# EAGLE design moodlight (EAGLE 6.5.0)
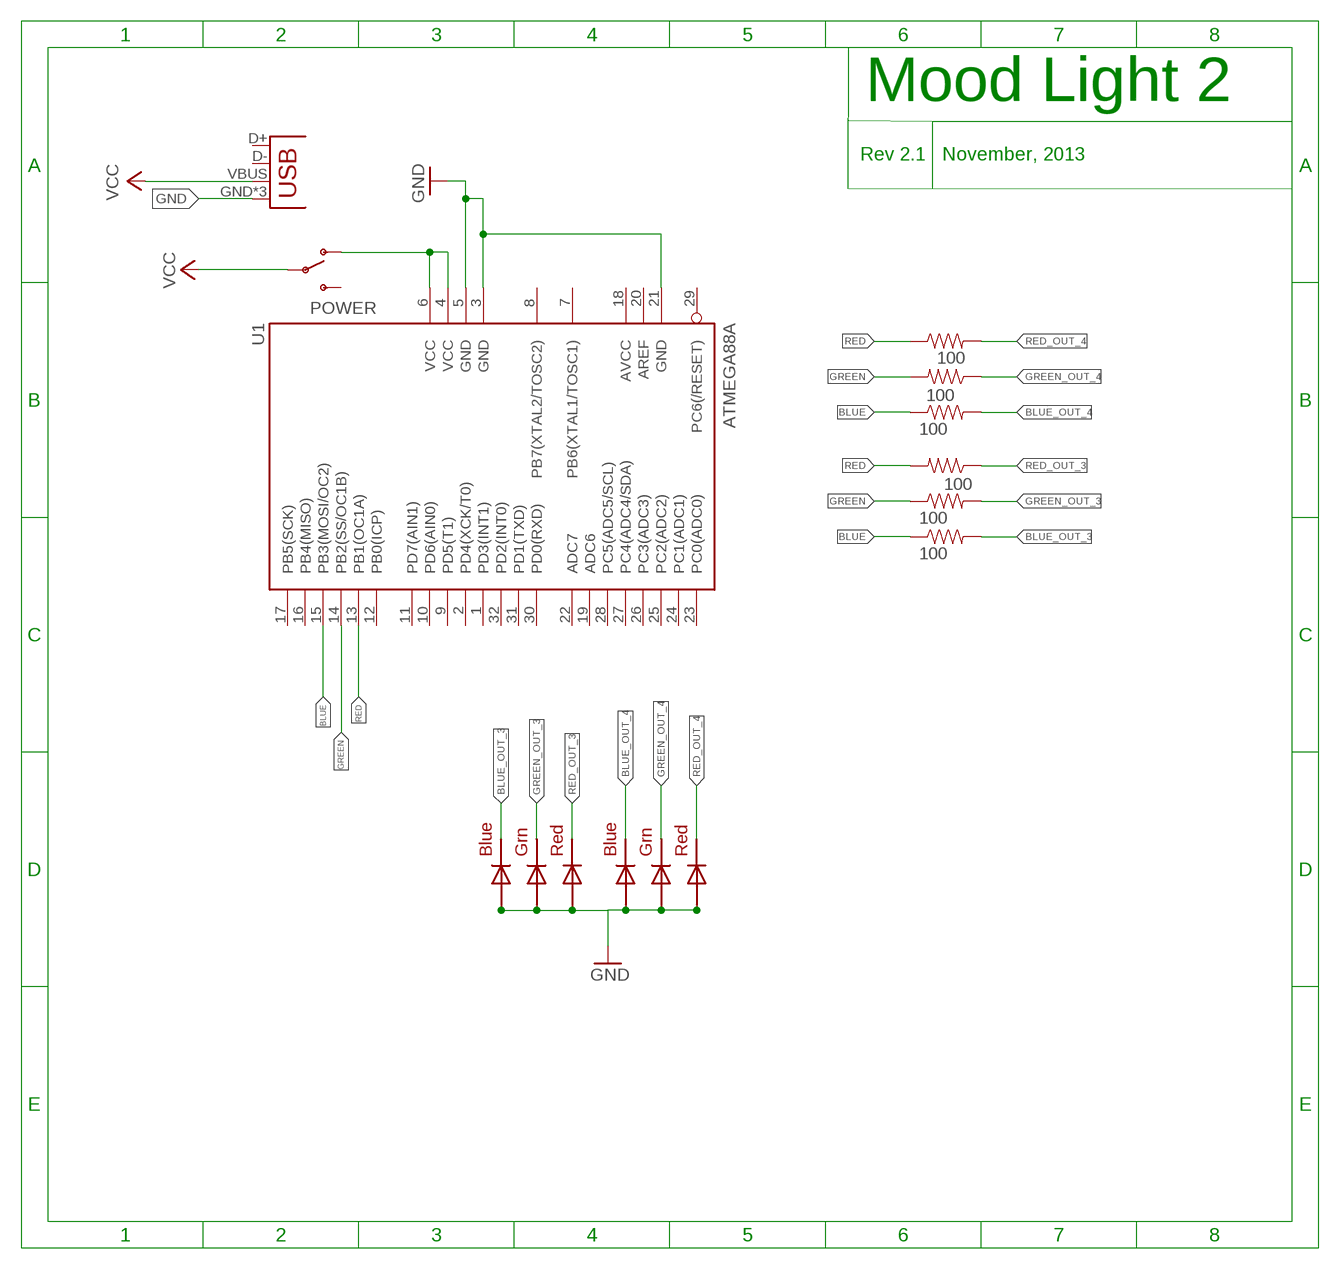
[diagram p0: schematic, sheet 1]

## Parts
JP2  USB-MICROB  [USB-MICROB]
LED3  RGBLED5050  [RGBLED5050]
LED4  RGBLED5050  [RGBLED5050]
POWER  5V  SWITCH-SPDTPTH  [SWITCH-SPDT]
R1  100  220-5%  [0603-RES]
R2  100  220-5%  [0603-RES]
R3  100  220-5%  [0603-RES]
R4  100  220-5%  [0603-RES]
R5  100  220-5%  [0603-RES]
R6  100  220-5%  [0603-RES]
U1  ATMEGA88A  MEGA8-AI  [TQFP32-08]

## Nets
BLUE: R3.1 R6.1 U1.15(PB3(MOSI/OC2))
BLUE_OUT_3: LED3.4(BLUE_C) R6.2
BLUE_OUT_4: LED4.4(BLUE_C) R3.2
GND: JP2.GND JP2.MT1(GND) JP2.MT2(GND) LED3.1(GREEN_A) LED3.2(RED_A) LED3.3(BLUE_A) LED4.1(GREEN_A) LED4.2(RED_A) LED4.3(BLUE_A) U1.3(GND) U1.5(GND) U1.21(GND)
GREEN: R2.2 R5.1 U1.14(PB2(SS/OC1B))
GREEN_OUT_3: LED3.6(GREEN_C) R5.2
GREEN_OUT_4: LED4.6(GREEN_C) R2.1
N$1: POWER.1(O) U1.4(VCC) U1.6(VCC)
RED: R1.1 R4.2 U1.13(PB1(OC1A))
RED_OUT_3: LED3.5(RED_C) R4.1
RED_OUT_4: LED4.5(RED_C) R1.2
VCC: JP2.VBUS POWER.2(P)
Unconnected: JP2.D+ JP2.D- POWER.3(S) U1.1(PD3(INT1)) U1.2(PD4(XCK/T0)) U1.7(PB6(XTAL1/TOSC1)) U1.8(PB7(XTAL2/TOSC2)) U1.9(PD5(T1)) U1.10(PD6(AIN0)) U1.11(PD7(AIN1)) U1.12(PB0(ICP)) U1.16(PB4(MISO)) U1.17(PB5(SCK)) U1.19(ADC6) U1.20(AREF) U1.22(ADC7) U1.23(PC0(ADC0)) U1.24(PC1(ADC1)) U1.25(PC2(ADC2)) U1.26(PC3(ADC3)) U1.27(PC4(ADC4/SDA)) U1.28(PC5(ADC5/SCL)) U1.29(PC6(/RESET)) U1.30(PD0(RXD)) U1.31(PD1(TXD)) U1.32(PD2(INT0))

## Notes on the sheet
- Mood Light 2
- Rev 2.1   November, 2013

## Power pins joined to a net without a drawn wire
AVCC: U1.18(AVCC)

## Library data of the parts
JP2 = SparkFun-Connectors:USB: USB Connectors USB-B-PTH is fully proven SKU : PRT-00139/CONN-08278 USB-miniB is fully proven SKU : PRT-00587 USB-A-PCB is untested. USB-A-H is throughly reviewed, but untested. Spark Fun Electronics SKU : PRT-00437 USB-B-SMT is throughly reviewed, but untested. Needs silkscreen touching up. USB-A-S has not been used/tested USB-MB-H has not been used/tested USB-MICROB has been used. CONN-09505; PROD_ID: CONN-09505
LED3 LED4 = adafruit:RGBLED: For 5050 RGB LEDs, the order of the LEDs may vary from one manufacturer to another!
POWER = SparkFun-Electromechanical:SWITCH-SPDT: SPDT Switch Simple slide switch, Spark Fun Electronics SKU : COM-00102 DPDT SMT slide switch, AYZ0202, SWCH-08179
R1-R6 = SparkFun-Resistors:220-5%: 220-ohm SMT 1/8W - 5% (0805) RES-07866; PROD_ID: RES-07866; VALUE: 220
U1 = atmel:MEGA8: MICROCONTROLLER 8 Kbytes FLASH, 1 kbytes SRAM, 512 bytes EEPROM, USART, 6-channel 10 bit ADC, 2-channel 8 bit ADC Pin compatible with Atmega48, ATMega88, ATMega168 Source: avr.lbr; MPN: ATMEGA8-16AU; OC_FARNELL: 9171371; OC_NEWARK: 73M8863

## Net classes
0 default: width 0.305 mm, drill 0.508 mm, clearance 0.254 mm

## Board
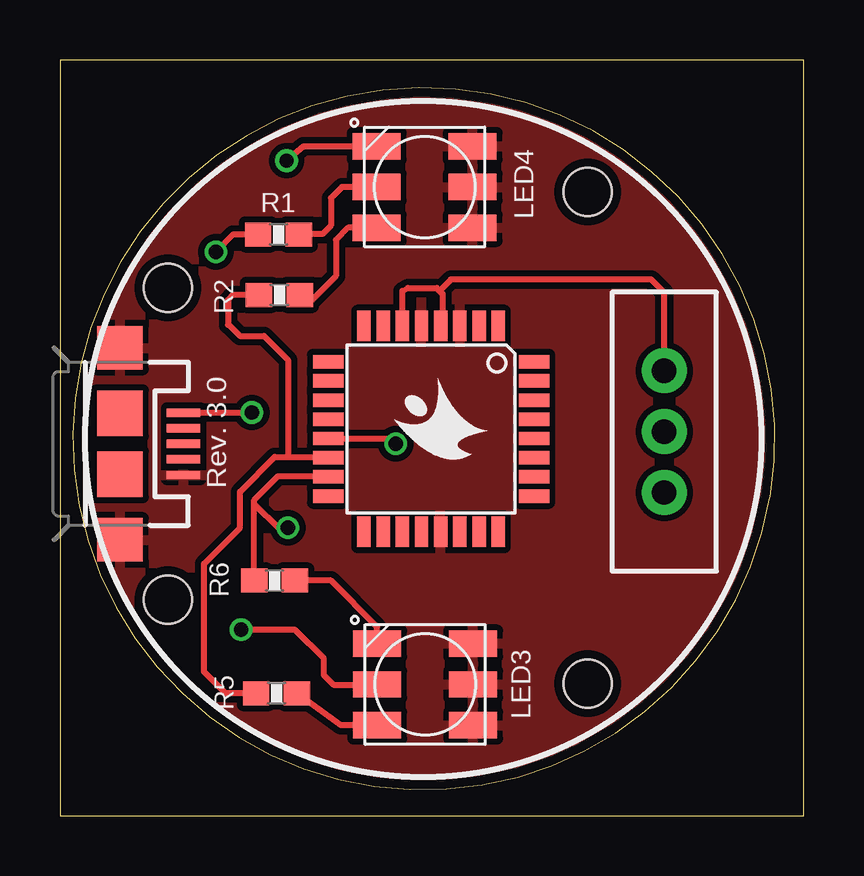
[diagram p1: board, top side]
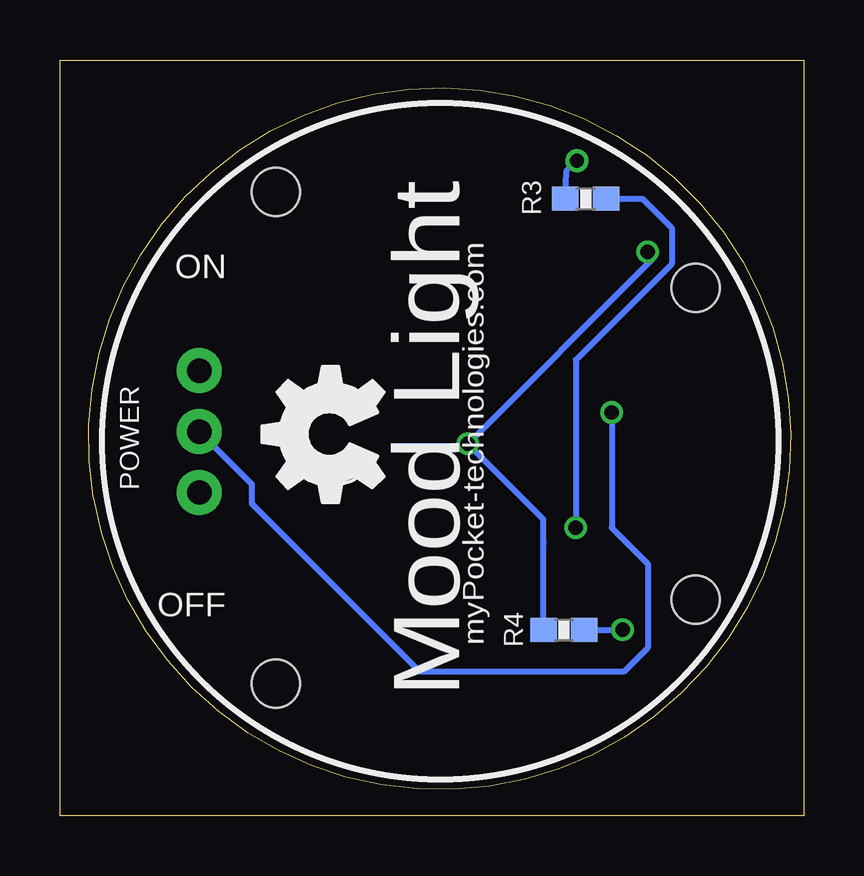
[diagram p2: board, bottom side, seen from below]

Size 31 x 31.5 mm. Coordinates in mm from the lower left corner, seen from the top.
Outline: 29.61,13.29 arc360 29.6,13.25
Outline: 0,0 31,0 31,31.5 0,31.5 0,0
Copper layers (1*16): Top 0.0356mm / dielectric 1.5011mm / Bottom 0.0356mm
Design rules "LeanPCBORder": minimum track width 6mil, minimum drill 13mil, track to track 6mil, track to pad 6mil, pad to pad 6mil, via to via 6mil, smd to smd 6mil, copper to edge 15mil, drill to drill 6mil, minimum pad ring 7mil, minimum via ring 7mil, stop-mask expansion 4mil, vias tented up to drill 0mil, thermal gap 10mil
Holes 2 mm at 4.5,22 4.5,9 22,5.5 22,26

### Footprints (pad centres in the part's own frame; a part is rotated, then mirrored left to right if it is on the bottom)
USB-MICROB = smd 0.35 x 1.4: D+ 0,2.65; D- -0.65,2.65; GND 1.3,2.65; ID 0.65,2.65; VBUS -1.3,2.65 | smd 1.8 x 1.9: MT1 -4,0; MT2 4,0 | smd 1.9 x 1.9: P$1 -1.27,0; P$2 1.27,0
RGBLED5050 = smd 2 x 1.1: 1 -2,1.7; 2 -2,0; 3 -2,-1.7; 4 2,-1.7; 5 2,0; 6 2,1.7
SWITCH-SPDT = drill 1.016 pad 1.88: 1 0,2.54; 2 0,0; 3 0,-2.54
0603-RES = smd 1.1 x 1: 1 -0.85,0; 2 0.85,0
TQFP32-08 = smd 1.27 x 0.559: 1 -4.293,2.8; 2 -4.293,2; 3 -4.293,1.2; 4 -4.293,0.4; 5 -4.293,-0.4; 6 -4.293,-1.2; 7 -4.293,-2; 8 -4.293,-2.8; 17 4.293,-2.8; 18 4.293,-2; 19 4.293,-1.2; 20 4.293,-0.4; 21 4.293,0.4; 22 4.293,1.2; 23 4.293,2; 24 4.293,2.8 | smd 0.559 x 1.27: 9 -2.8,-4.293; 10 -2,-4.293; 11 -1.2,-4.293; 12 -0.4,-4.293; 13 0.4,-4.293; 14 1.2,-4.293; 15 2,-4.293; 16 2.8,-4.293; 25 2.8,4.293; 26 2,4.293; 27 1.2,4.293; 28 0.4,4.293; 29 -0.4,4.293; 30 -1.2,4.293; 31 -2,4.293; 32 -2.8,4.293

### Placement (x,y rotation side)
JP2  2.5,15.5 270 top
LED3  15.23,5.47 180 top
LED4  15.21,26.2 180 top
POWER  25.2,16.01 0 top
R1  9.11,24.22 0 top
R2  9.15,21.7 180 top
R3  9.08,25.71 180 bottom
R4  9.99,7.74 180 bottom
R5  9.03,5.1 0 top
R6  8.95,9.8 0 top
U1  15.47,16.12 270 top
U$1  [OSHW_FILLX200_NOTEXT]  17.48,13.06 90 bottom
U$2  [MYPOCKETLOGO_SM]  16.31,15.09 90 top

### Tracks (layer width: path | path; a pad name or v marks a point on that pad's centre or on a via)
BLUE  (via drill 0.6)
  Top 0.254: R6.1 8.1,13 | 8.1,13 8.1,13.15 9.1,14.15 11.15,14.15 U1.15 | v9.5,12 9.55,11.95 9.15,11.95 8.1,13
  Bottom 0.254: R3.1 6.71,25.71 5.5,24.5 5.5,23 9.5,19 v9.5,12
BLUE_OUT_3
  Top 0.254: LED3.4 13.23,7.87 11.3,9.8 R6.2
BLUE_OUT_4  (via drill 0.6)
  Top 0.254: v9.45,27.3 9.6,27.6 9.65,27.55 9.65,27.5 10.15,27.9 LED4.4
  Bottom 0.254: R3.2 9.88,26.88 v9.45,27.3
GND
  pour Top: -0.5,0 30.5,0 30.5,32 -0.5,32
GREEN
  Top 0.254: R5.1 6.9,5.1 6,6 6,10.5 7.5,12 7.5,13.5 8.95,14.95 9.5,14.95 | 9.5,14.95 11.15,14.95 U1.14 | R2.2 7.2,21.7 7,21.5 7,20.45 7.05,20.45 7.5,20 8.5,20 9.5,19 9.5,14.95
GREEN_OUT_3
  Top 0.254: LED3.6 11.71,3.77 R5.2
GREEN_OUT_4
  Top 0.254: LED4.6 12,24.5 11.5,24 11.5,22.5 10.5,21.5 10.2,21.5 R2.1
N$1
  Top 0.254: U1.6 14.27,21.87 14.5,22 15.7,22 15.82,21.88 | 15.82,21.88 15.95,21.75 15.95,20.68 U1.4 | POWER.1 25.2,21.8 24.65,22.35 16.3,22.35 15.82,21.88
RED  (via drill 0.6)
  Top 0.254: v14,15.5 13.75,15.7 11.05,15.7 U1.13 | R1.1 7.22,24.22 v6.5,23.5
  Bottom 0.254: R4.2 10.84,11.34 10.85,11.35 10.85,12.35 v14,15.5 6.3,23.2 6.3,23.35 6.45,23.5 v6.5,23.5
RED_OUT_3  (via drill 0.6)
  Top 0.254: 7.45,7.75 v7.55,7.75 9.8,7.75 11,6.55 11,5.85 11.4,5.45 13.21,5.45 LED3.5
  Bottom 0.254: R4.1 8.06,7.74 v7.55,7.75
RED_OUT_4
  Top 0.254: LED4.5 11.75,26.2 11.3,25.75 11.3,24.6 10.95,24.25 9.99,24.25 R1.2
VCC  (via drill 0.6)
  Top 0.254: JP2.VBUS v8,16.8
  Bottom 0.254: v8,16.8 8,12 6.5,10.5 6.5,7 7.5,6 16,6 23,13 23,13.81 POWER.2

### Text on the board
tNames: Rev. 3.0
bNames: ON | myPocket-technologies.com | Mood Light | OFF